# Altium project PCB_Project.PrjPcb
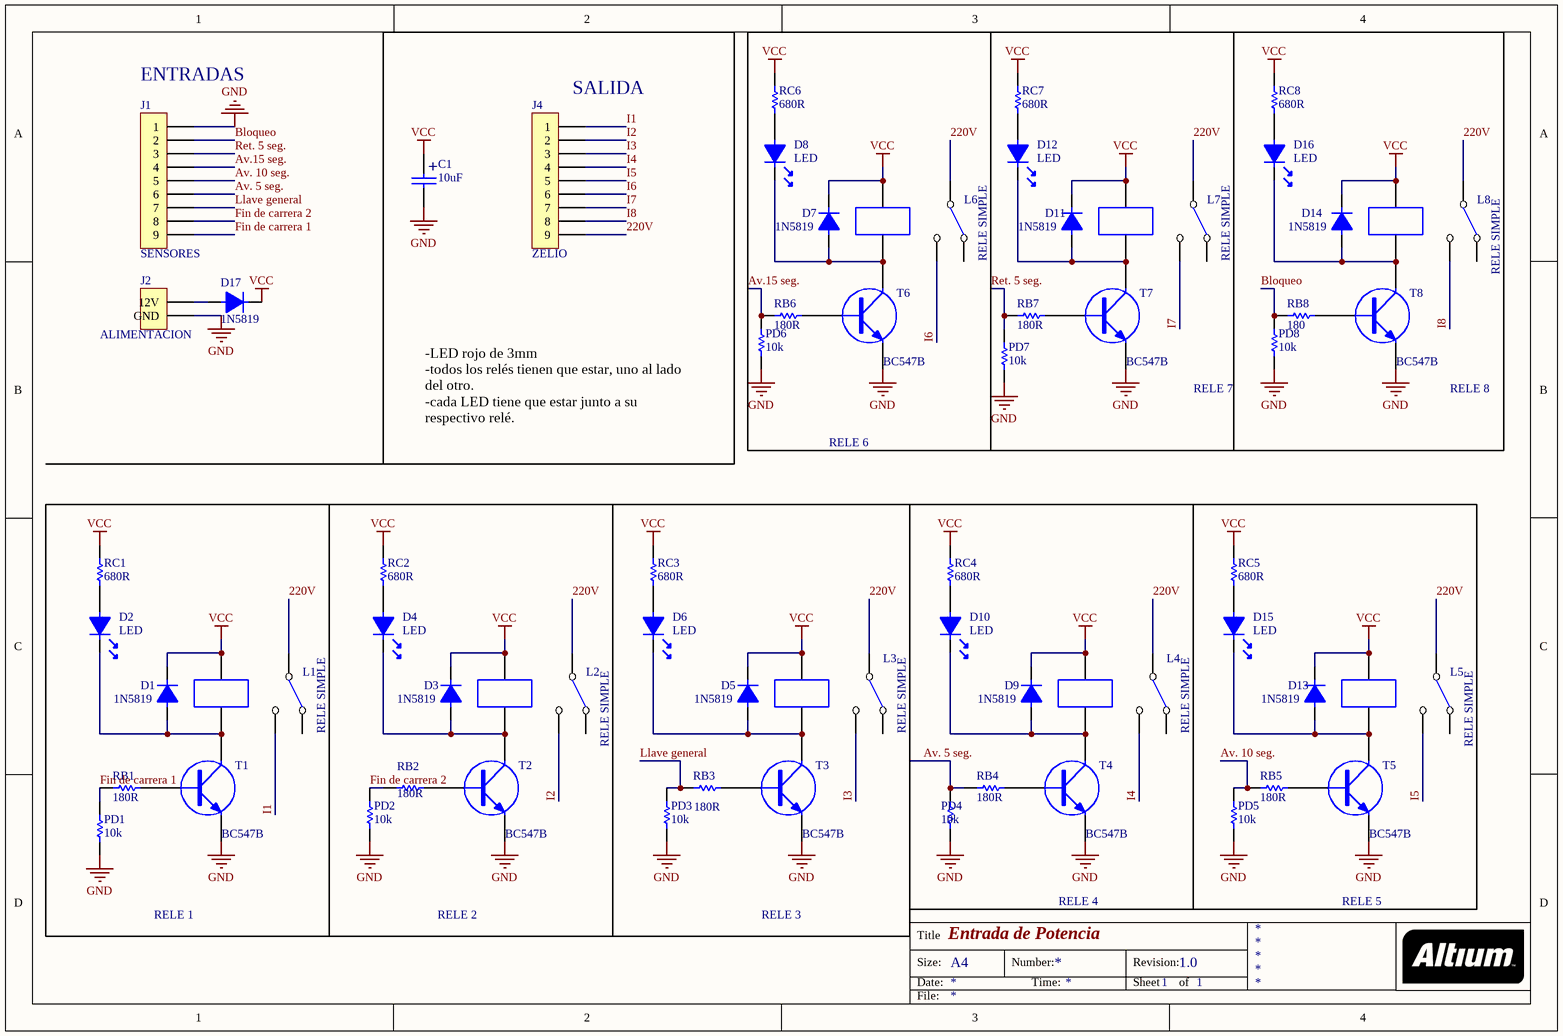
[diagram p0: ETAPA DE POTENCIA (1).SchDoc]
1 sheet, 61 parts. Net scope: global (net labels, ports and power ports of the same name join across sheets).
Board files: ETAPA DE POTENCIA (TERMINADA).PcbDoc, panel.PcbDoc

## Sheet ETAPA DE POTENCIA (1).SchDoc: Entrada de Potencia
size A4; Revision: 1.0; SheetNumber: 1; SheetTotal: 1; DocumentName: ETAPA DE POTENCIA

### Parts
C1  10uF  [CAP100RP]
D1  1N5819  [DO41]
D2  LED  [LED3]
D3  1N5819  [DO41]
D4  LED  [LED3]
D5  1N5819  [DO41]
D6  LED  [LED3]
D7  1N5819  [DO41]
D8  LED  [LED3]
D9  1N5819  [DO41]
D10  LED  [LED3]
D11  1N5819  [DO41]
D12  LED  [LED3]
D13  1N5819  [DO41]
D14  1N5819  [DO41]
D15  LED  [LED3]
D16  LED  [LED3]
D17  1N5819  [DO41]
J1  SENSORES  [BORNERA9]
J2  ALIMENTACION  [BORNERA2]
J4  ZELIO  [BORNERA9]
L1  RELE SIMPLE  [RELE SERIE 964]
L2  RELE SIMPLE  [RELE SERIE 964]
L3  RELE SIMPLE  [RELE SERIE 964]
L4  RELE SIMPLE  [RELE SERIE 964]
L5  RELE SIMPLE  [RELE SERIE 964]
L6  RELE SIMPLE  [RELE SERIE 964]
L7  RELE SIMPLE  [RELE SERIE 964]
L8  RELE SIMPLE  [RELE SERIE 964]
PD1  10k  [RES400]
PD2  10k  [RES400]
PD3  10k  [RES400]
PD4  10k  [RES400]
PD5  10k  [RES400]
PD6  10k  [RES400]
PD7  10k  [RES400]
PD8  10k  [RES400]
RB1  180R  [RES400]
RB2  180R  [RES400]
RB3  180R  [RES400]
RB4  180R  [RES400]
RB5  180R  [RES400]
RB6  180R  [RES400]
RB7  180R  [RES400]
RB8  180  [RES400]
RC1  680R  [RES400]
RC2  680R  [RES400]
RC3  680R  [RES400]
RC4  680R  [RES400]
RC5  680R  [RES400]
RC6  680R  [RES400]
RC7  680R  [RES400]
RC8  680R  [RES400]
T1  BC547B  [TO92]
T2  BC547B  [TO92]
T3  BC547B  [TO92]
T4  BC547B  [TO92]
T5  BC547B  [TO92]
T6  BC547B  [TO92]
T7  BC547B  [TO92]
T8  BC547B  [TO92]

### Blocks framed on the sheet
RELE 6: D7 D8 L6 PD6 RB6 RC6 T6
RELE 7: D11 D12 L7 PD7 RB7 RC7 T7
RELE 8: D14 D16 L8 PD8 RB8 RC8 T8
RELE 3: D5 D6 L3 PD3 RB3 RC3 T3
RELE 4: D9 D10 L4 PD4 RB4 RC4 T4
RELE 5: D13 D15 L5 PD5 RB5 RC5 T5

### Nets
GND: C1.2 J1.1 J2.2(GND) PD1.1 PD2.1 PD3.1 PD4.1 PD5.1 PD6.1 PD7.1 PD8.1 T1.3(E) T2.3(E) T3.3(E) T4.3(E) T5.3(E) T6.3(E) T7.3(E) T8.3(E)
VCC: C1.1 D1.2 D3.2 D5.2 D7.2 D9.2 D11.2 D13.2 D14.2 D17.2 L1.B2 L2.B2 L3.B2 L4.B2 L5.B2 L6.B2 L7.B2 L8.B2 RC1.1 RC2.1 RC3.1 RC4.1 RC5.1 RC6.1 RC7.1 RC8.1
220V: J4.9 L1.C1 L2.C1 L3.C1 L4.C1 L5.C1 L6.C1 L7.C1 L8.C1
Av.15 seg.: J1.4 PD6.2 RB6.1
Av. 5 seg.: J1.6 PD4.2 RB4.1
Av. 10 seg.: J1.5 PD5.2 RB5.1
Bloqueo: J1.2 PD8.2 RB8.1
Fin de carrera 1: J1.9 PD1.2 RB1.1
Fin de carrera 2: J1.8 PD2.2 RB2.1
I1: J4.1 L1.NA1
I2: J4.2 L2.NA1
I3: J4.3 L3.NA1
I4: J4.4 L4.NA1
I5: J4.5 L5.NA1
I6: J4.6 L6.NA1
I7: J4.7 L7.NA1
I8: J4.8 L8.NA1
Llave general: J1.7 PD3.2 RB3.1
Ret. 5 seg.: J1.3 PD7.2 RB7.1
NetD1_1: D1.1 D2.2 L1.B1 T1.2(C)
NetD2_1: D2.1 RC1.2
NetD3_1: D3.1 D4.2 L2.B1 T2.2(C)
NetD4_1: D4.1 RC2.2
NetD5_1: D5.1 D6.2 L3.B1 T3.2(C)
NetD6_1: D6.1 RC3.2
NetD7_1: D7.1 D8.2 L6.B1 T6.2(C)
NetD8_1: D8.1 RC6.2
NetD9_1: D9.1 D10.2 L4.B1 T4.2(C)
NetD10_1: D10.1 RC4.2
NetD11_1: D11.1 D12.2 L7.B1 T7.2(C)
NetD12_1: D12.1 RC7.2
NetD13_1: D13.1 D15.2 L5.B1 T5.2(C)
NetD14_1: D14.1 D16.2 L8.B1 T8.2(C)
NetD15_1: D15.1 RC5.2
NetD16_1: D16.1 RC8.2
NetD17_1: D17.1 J2.1(12V)
NetRB1_2: RB1.2 T1.1(B)
NetRB2_2: RB2.2 T2.1(B)
NetRB3_2: RB3.2 T3.1(B)
NetRB4_2: RB4.2 T4.1(B)
NetRB5_2: RB5.2 T5.1(B)
NetRB6_2: RB6.2 T6.1(B)
NetRB7_2: RB7.2 T7.1(B)
NetRB8_2: RB8.2 T8.1(B)

Not connected (* = marked no-connect by the designer): L1 NC1; L2 NC1; L3 NC1; L4 NC1; L5 NC1; L6 NC1; L7 NC1; L8 NC1

### Notes on the sheet
- (near J1) ENTRADAS
- (near J4) SALIDA
- -LED rojo de 3mm
  -todos los relés tienen que estar, uno al lado del otro.
  -cada LED tiene que estar junto a su respectivo relé.
- RELE 1
- RELE 2
- Title
- Size:
- Date:
- A4
- Number:
- Time:
- Revision:
- Sheet
- of
- File:
- (in symbol CAPPOL) +

### Library data of the parts
C1 = CAPPOL
D1 D3 D5 D7 D9 D11 D13 D14 D17 = DIODO
J1 J4 = BORNERA 9
J2 = BORNERA 2
PD1-PD8 RB1-RB8 RC1-RC8 = RES
T1-T8 = TRANSISTOR NPN